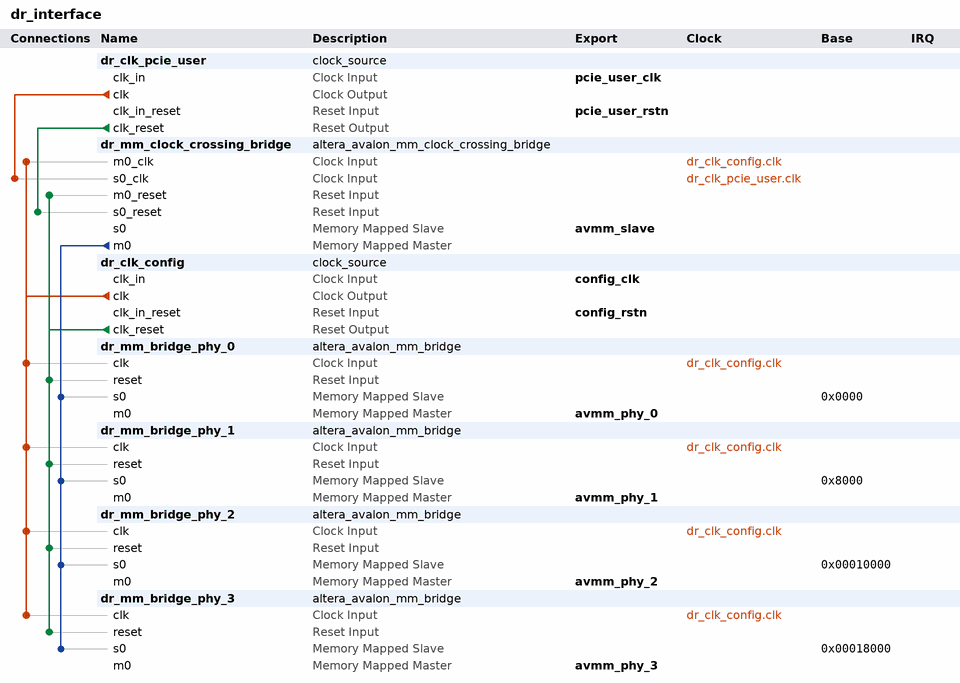
[diagram p0: system contents]
# Platform Designer (Qsys) system dr_interface, Stratix 10 1SM21CHU2F53E2VG
# Parameters at their usual value, and those the tool derives, are not listed.
package require -exact qsys 1.0
create_system dr_interface
set_project_property DEVICE_FAMILY {Stratix 10}
set_project_property DEVICE 1SM21CHU2F53E2VG

add_component dr_clk_pcie_user ip/dr_interface/dr_clk_pcie_user.ip clock_source dr_clk_pcie_user 

add_component dr_mm_clock_crossing_bridge ip/dr_interface/dr_mm_clock_crossing_bridge.ip altera_avalon_mm_clock_crossing_bridge dr_mm_clock_crossing_bridge 19.1
load_component dr_mm_clock_crossing_bridge
set_component_parameter_value DATA_WIDTH 32
set_component_parameter_value ADDRESS_WIDTH 18
set_component_parameter_value USE_AUTO_ADDRESS_WIDTH 0
set_component_parameter_value MAX_BURST_SIZE 1
set_component_parameter_value COMMAND_FIFO_DEPTH 128
set_component_parameter_value RESPONSE_FIFO_DEPTH 128
set_component_parameter_value MASTER_SYNC_DEPTH 2
set_component_parameter_value SLAVE_SYNC_DEPTH 2
set_component_parameter_value SYNC_RESET 0
save_component

add_component dr_clk_config ip/dr_interface/dr_clk_config.ip clock_source dr_clk_config 
load_component dr_clk_config
set_component_parameter_value clockFrequency 50000000
set_component_parameter_value resetSynchronousEdges DEASSERT
save_component

add_component dr_mm_bridge_phy_0 ip/dr_interface/dr_mm_bridge_1.ip altera_avalon_mm_bridge dr_mm_bridge_phy_0 19.1
load_component dr_mm_bridge_phy_0
set_component_parameter_value DATA_WIDTH 32
set_component_parameter_value ADDRESS_WIDTH 13
set_component_parameter_value USE_AUTO_ADDRESS_WIDTH 0
set_component_parameter_value ADDRESS_UNITS WORDS
set_component_parameter_value MAX_PENDING_RESPONSES 4
set_component_parameter_value SYNC_RESET 0
save_component

add_component dr_mm_bridge_phy_1 ip/dr_interface/dr_mm_bridge_1.ip altera_avalon_mm_bridge dr_mm_bridge_phy_1 19.1
load_component dr_mm_bridge_phy_1
set_component_parameter_value DATA_WIDTH 32
set_component_parameter_value ADDRESS_WIDTH 13
set_component_parameter_value USE_AUTO_ADDRESS_WIDTH 0
set_component_parameter_value ADDRESS_UNITS WORDS
set_component_parameter_value MAX_PENDING_RESPONSES 4
set_component_parameter_value SYNC_RESET 0
save_component

add_component dr_mm_bridge_phy_2 ip/dr_interface/dr_mm_bridge_1.ip altera_avalon_mm_bridge dr_mm_bridge_phy_2 19.1
load_component dr_mm_bridge_phy_2
set_component_parameter_value DATA_WIDTH 32
set_component_parameter_value ADDRESS_WIDTH 13
set_component_parameter_value USE_AUTO_ADDRESS_WIDTH 0
set_component_parameter_value ADDRESS_UNITS WORDS
set_component_parameter_value MAX_PENDING_RESPONSES 4
set_component_parameter_value SYNC_RESET 0
save_component

add_component dr_mm_bridge_phy_3 ip/dr_interface/dr_mm_bridge_1.ip altera_avalon_mm_bridge dr_mm_bridge_phy_3 19.1
load_component dr_mm_bridge_phy_3
set_component_parameter_value DATA_WIDTH 32
set_component_parameter_value ADDRESS_WIDTH 13
set_component_parameter_value USE_AUTO_ADDRESS_WIDTH 0
set_component_parameter_value ADDRESS_UNITS WORDS
set_component_parameter_value MAX_PENDING_RESPONSES 4
set_component_parameter_value SYNC_RESET 0
save_component

# connections
add_connection dr_clk_config.clk dr_mm_bridge_phy_0.clk clock
add_connection dr_clk_config.clk dr_mm_bridge_phy_1.clk clock
add_connection dr_clk_config.clk dr_mm_bridge_phy_2.clk clock
add_connection dr_clk_config.clk dr_mm_bridge_phy_3.clk clock
add_connection dr_clk_config.clk dr_mm_clock_crossing_bridge.m0_clk clock
add_connection dr_clk_pcie_user.clk dr_mm_clock_crossing_bridge.s0_clk clock
add_connection dr_clk_config.clk_reset dr_mm_bridge_phy_0.reset reset
add_connection dr_clk_config.clk_reset dr_mm_bridge_phy_1.reset reset
add_connection dr_clk_config.clk_reset dr_mm_bridge_phy_2.reset reset
add_connection dr_clk_config.clk_reset dr_mm_bridge_phy_3.reset reset
add_connection dr_clk_config.clk_reset dr_mm_clock_crossing_bridge.m0_reset reset
add_connection dr_clk_pcie_user.clk_reset dr_mm_clock_crossing_bridge.s0_reset reset
add_connection dr_mm_clock_crossing_bridge.m0 dr_mm_bridge_phy_0.s0 avalon
set_connection_parameter_value dr_mm_clock_crossing_bridge.m0/dr_mm_bridge_phy_0.s0 baseAddress 0x0000
add_connection dr_mm_clock_crossing_bridge.m0 dr_mm_bridge_phy_1.s0 avalon
set_connection_parameter_value dr_mm_clock_crossing_bridge.m0/dr_mm_bridge_phy_1.s0 baseAddress 0x8000
add_connection dr_mm_clock_crossing_bridge.m0 dr_mm_bridge_phy_2.s0 avalon
set_connection_parameter_value dr_mm_clock_crossing_bridge.m0/dr_mm_bridge_phy_2.s0 baseAddress 0x00010000
add_connection dr_mm_clock_crossing_bridge.m0 dr_mm_bridge_phy_3.s0 avalon
set_connection_parameter_value dr_mm_clock_crossing_bridge.m0/dr_mm_bridge_phy_3.s0 baseAddress 0x00018000

# exported interfaces
add_interface avmm_phy_0 avalon master
set_interface_property avmm_phy_0 EXPORT_OF dr_mm_bridge_phy_0.m0
add_interface avmm_phy_1 avalon master
set_interface_property avmm_phy_1 EXPORT_OF dr_mm_bridge_phy_1.m0
add_interface avmm_phy_2 avalon master
set_interface_property avmm_phy_2 EXPORT_OF dr_mm_bridge_phy_2.m0
add_interface avmm_phy_3 avalon master
set_interface_property avmm_phy_3 EXPORT_OF dr_mm_bridge_phy_3.m0
add_interface avmm_slave avalon slave
set_interface_property avmm_slave EXPORT_OF dr_mm_clock_crossing_bridge.s0
add_interface config_clk clock sink
set_interface_property config_clk EXPORT_OF dr_clk_config.clk_in
add_interface config_rstn reset sink
set_interface_property config_rstn EXPORT_OF dr_clk_config.clk_in_reset
add_interface pcie_user_clk clock sink
set_interface_property pcie_user_clk EXPORT_OF dr_clk_pcie_user.clk_in
add_interface pcie_user_rstn reset sink
set_interface_property pcie_user_rstn EXPORT_OF dr_clk_pcie_user.clk_in_reset

save_system dr_interface.qsys
